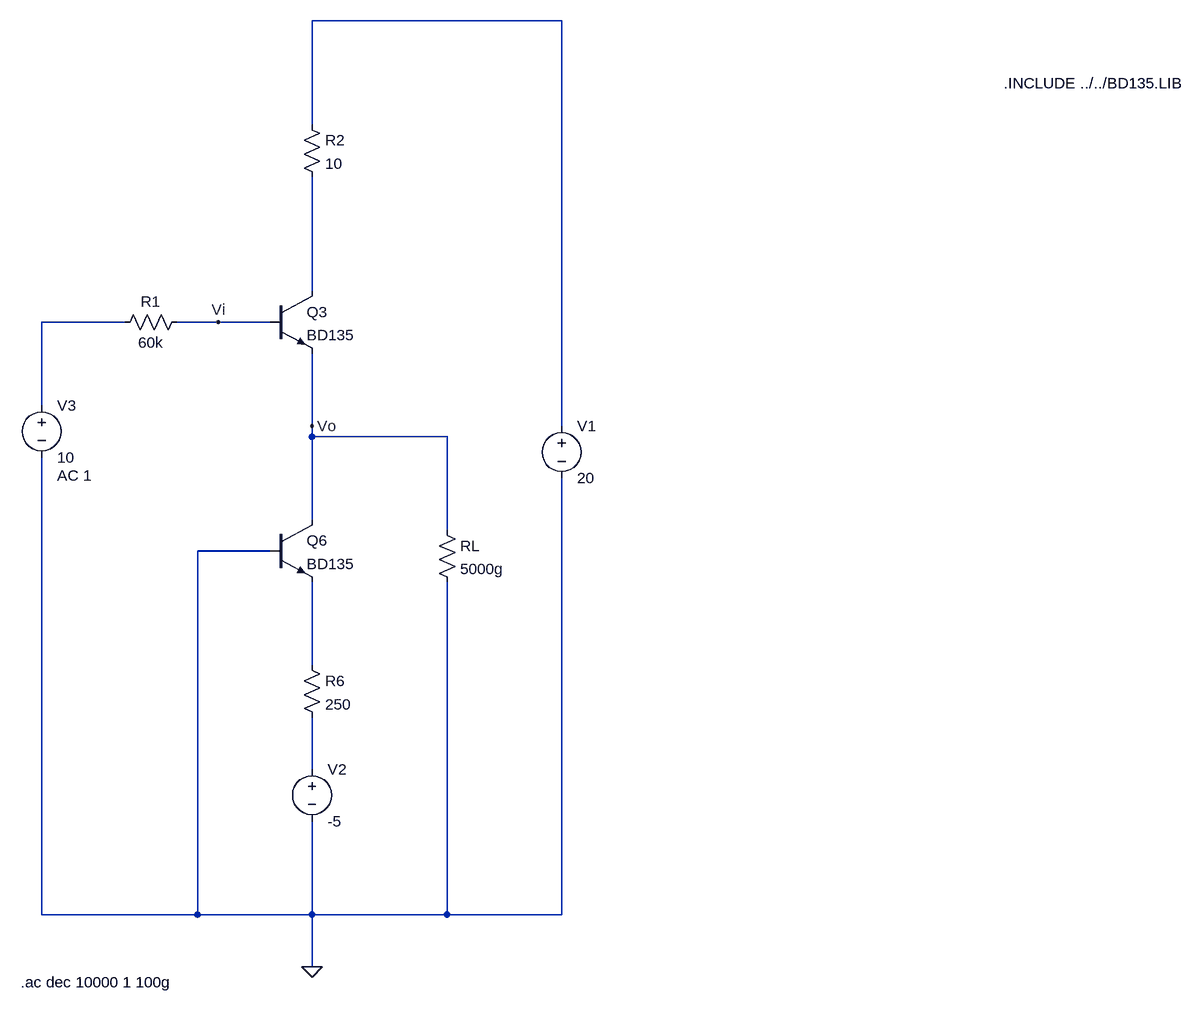
[diagram p0: schematic ri.asc]
ri.asc, the LTspice schematic file:
Version 4
SHEET 1 1572 1176
WIRE 592 -320 208 -320
WIRE 208 -160 208 -320
WIRE 208 96 208 -80
WIRE -80 144 -208 144
WIRE 64 144 0 144
WIRE 144 144 64 144
WIRE -208 272 -208 144
WIRE 208 304 208 192
WIRE 592 304 592 -320
WIRE 208 320 208 304
WIRE 416 320 208 320
WIRE 208 448 208 320
WIRE 416 464 416 320
WIRE 144 496 32 496
WIRE 208 672 208 544
WIRE 208 832 208 752
WIRE -208 1056 -208 352
WIRE 32 1056 32 496
WIRE 32 1056 -208 1056
WIRE 208 1056 208 912
WIRE 208 1056 32 1056
WIRE 416 1056 416 544
WIRE 416 1056 208 1056
WIRE 592 1056 592 384
WIRE 592 1056 416 1056
WIRE 208 1136 208 1056
FLAG 208 1136 0
FLAG 208 304 Vo
FLAG 64 144 Vi
SYMBOL npn 144 96 R0
SYMATTR InstName Q3
SYMATTR Value BD135
SYMBOL npn 144 448 R0
SYMATTR InstName Q6
SYMATTR Value BD135
SYMBOL res 192 656 R0
SYMATTR InstName R6
SYMATTR Value 250
SYMBOL res 192 -176 R0
SYMATTR InstName R2
SYMATTR Value 10
SYMBOL voltage 592 288 R0
WINDOW 123 0 0 Left 0
WINDOW 39 0 0 Left 0
SYMATTR InstName V1
SYMATTR Value 20
SYMBOL voltage 208 816 R0
WINDOW 123 0 0 Left 0
WINDOW 39 0 0 Left 0
SYMATTR InstName V2
SYMATTR Value -5
SYMBOL voltage -208 256 R0
WINDOW 123 24 124 Left 2
WINDOW 39 0 0 Left 0
SYMATTR Value2 AC 1
SYMATTR InstName V3
SYMATTR Value 10
SYMBOL res 400 448 R0
SYMATTR InstName RL
SYMATTR Value 5000g
SYMBOL res 16 128 R90
WINDOW 0 0 56 VBottom 2
WINDOW 3 32 56 VTop 2
SYMATTR InstName R1
SYMATTR Value 60k
TEXT 1272 -224 Left 2 !.INCLUDE ../../BD135.LIB
TEXT -240 1160 Left 2 !.ac dec 10000 1 100g

The netlist it stands for:
* ri.asc
Q3 N002 Vi Vo 0 BD135
Q6 Vo 0 N004 0 BD135
R6 N004 N005 250
R2 N001 N002 10
V1 N001 0 20
V2 N005 0 -5
V3 N003 0 10 AC 1
RL Vo 0 5000g
R1 Vi N003 60k
.model NPN NPN
.model PNP PNP
.lib standard.bjt
.INCLUDE ../../BD135.LIB
.ac dec 10000 1 100g
.backanno
.end